# Altium project WiWi_SDR.PrjPcb (part 1 of 5)
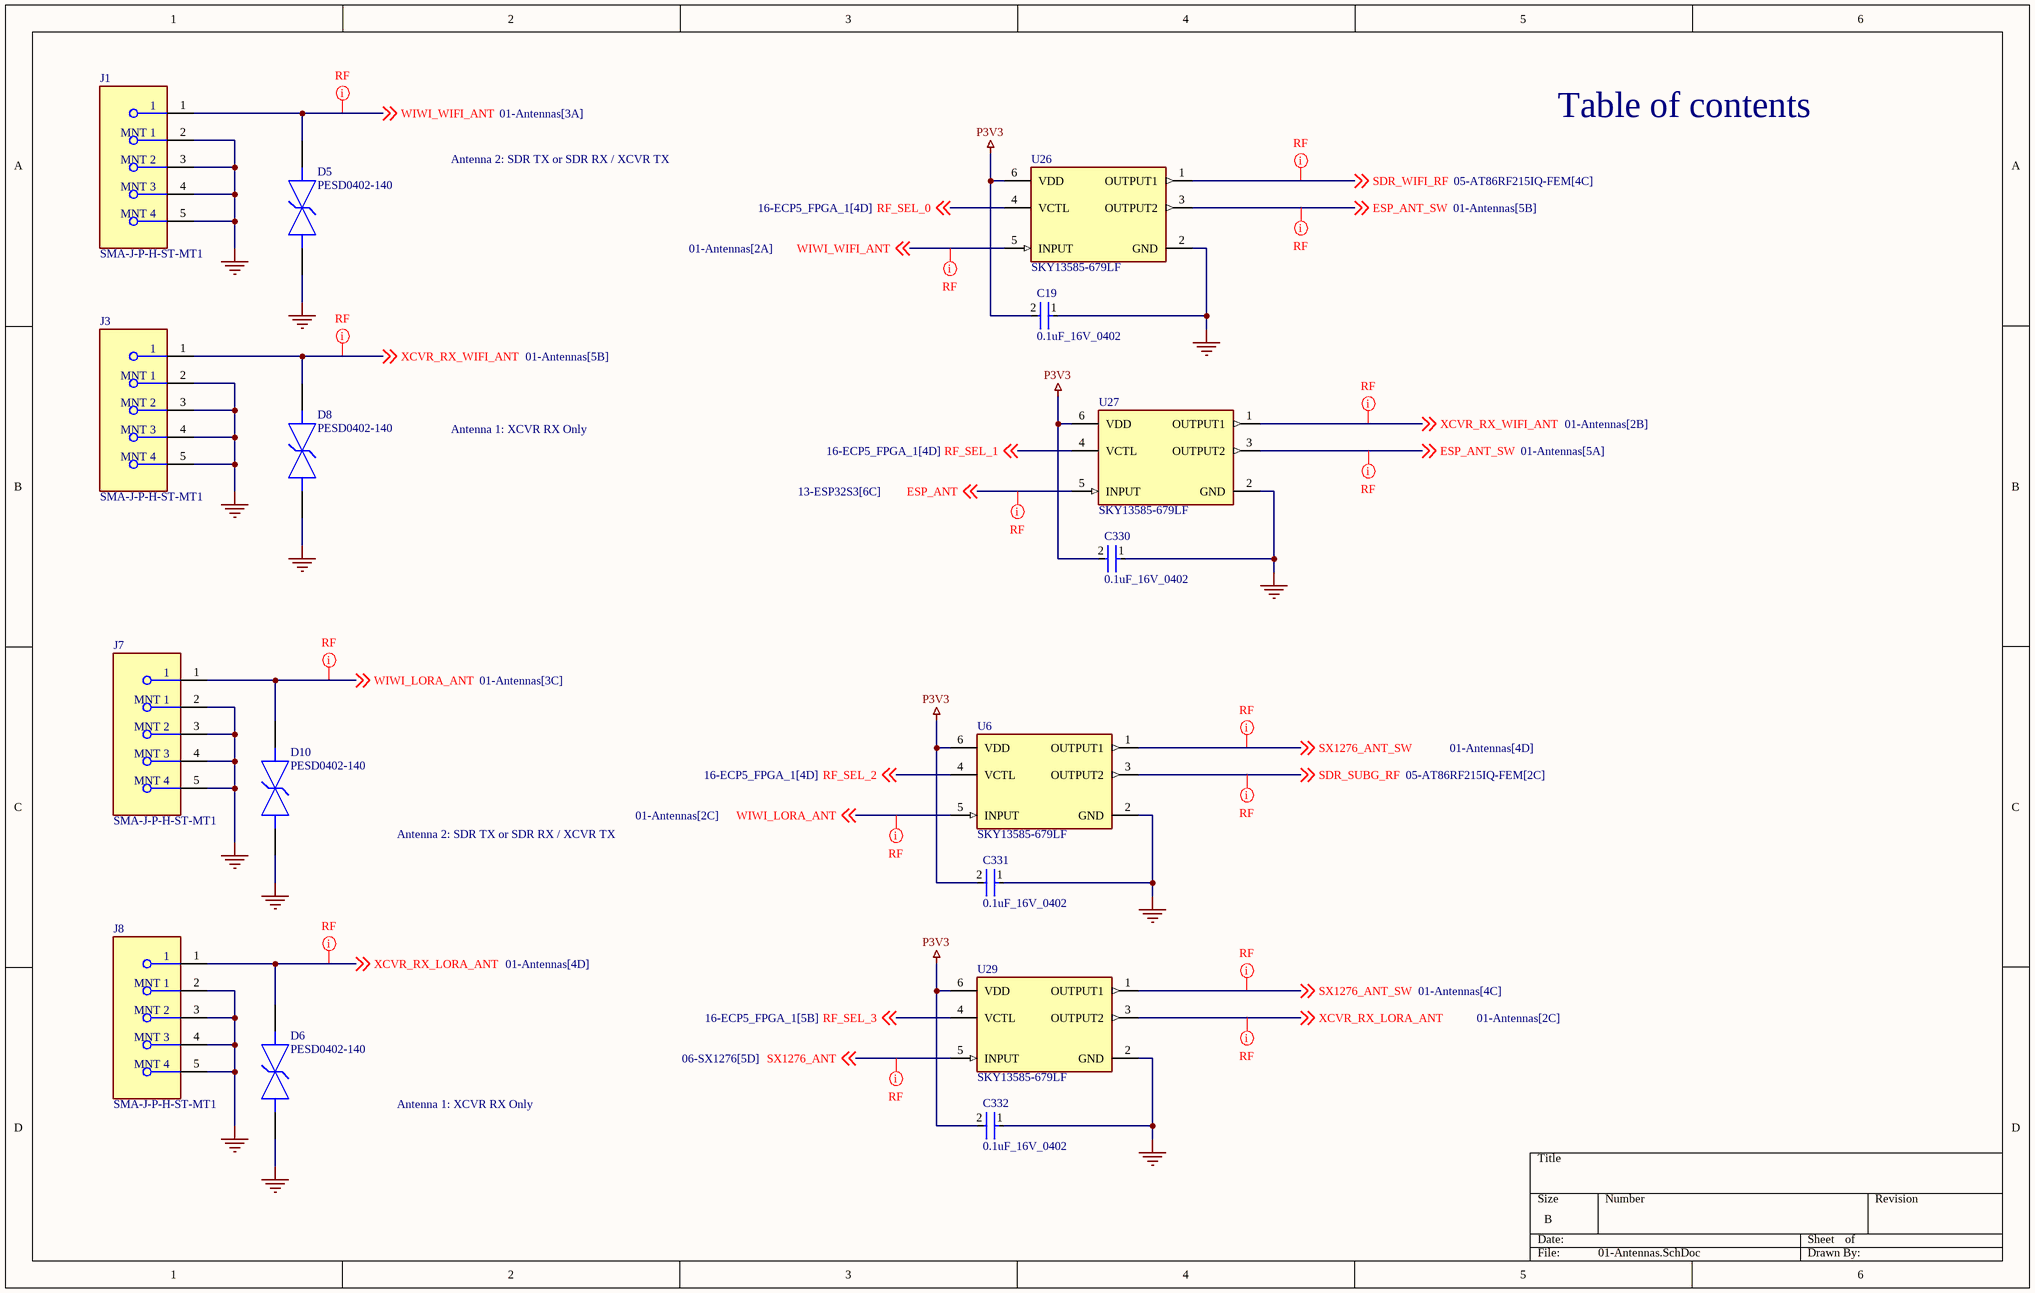
[diagram p0: 01-Antennas.SchDoc]
prjCompanyName: Meta Platforms Technologies, LLC.; prjContactAddress1: 9845 Willows Road NE; prjContactAddress2: Redmond, WA 98052; prjContactEmail: Contact Email; prjContactPhone: (...)-...-....; prjElectricalEngineer: Electical Engineer; prjElectricalEngineerEmail: Electical Engineer Email; prjLayoutEngineer: Layout Engineer; prjLayoutEngineerEmail: Layout Engineer Email; prjMechanicalEngineer: Mechanical Engineer; prjMechanicalEngineerEmail: Mechanical Engineer Email; prjPCB_IPN: 844-XXXXX-XX; prjPCB_Name: PCB Name; prjPCB_Revision: X1; prjProjectName: Project Name; prjSchematic_IPN: 846-XXXXX-XX; prjSchematic_Revision: X1; XprjPCBA_IPN: Set v_prjPCBA_IPN in variant parameters; XprjPCBA_Revision: Set v_prjPCBA_Revision in variant parameters
16 sheets, 513 parts. Net scope: global (net labels, ports and power ports of the same name join across sheets).
Board file: WiWi_SDR_V4.PcbDoc
Sheets:
  01-Antennas.SchDoc
  02-RCB_Header.SchDoc
  04-AT86RF215IQ.SchDoc
  05-AT86RF215IQ-FEM.SchDoc
  06-SX1276.SchDoc
  07-TCXO_Crystal.SchDoc
  08-STM32-01.SchDoc
  10-USB-Prog.SchDoc
  11-Power.SchDoc
  12-FPGA_Power.SchDoc
  13-ESP32S3.SchDoc
  14-DPLL_1.SchDoc
  16-ECP5_FPGA_1.SchDoc
  17-ECP5_FPGA_2.SchDoc
  18-USB_HS.SchDoc
  19-100M_Ethernet.SchDoc

## Sheet 01-Antennas.SchDoc
size B; SheetNumber: 1; SheetTotal: 19; SPICEModelCacheELOCFEDZ: <root> / <DocumentId>ELOCFEDZ</DocumentId> / </root>

### Parts
C19  0.1uF_16V_0402  [FP-C0402-BB-MFG]
C330  0.1uF_16V_0402  [FP-C0402-BB-MFG]
C331  0.1uF_16V_0402  [FP-C0402-BB-MFG]
C332  0.1uF_16V_0402  [FP-C0402-BB-MFG]
D5  PESD0402-140  [FP-PESD0402-MFG]
D6  PESD0402-140  [FP-PESD0402-MFG]
D8  PESD0402-140  [FP-PESD0402-MFG]
D10  PESD0402-140  [FP-PESD0402-MFG]
J1  SMA-J-P-H-ST-MT1  [FP-SMA-J-P-H-ST-MT1-MFG]
J3  SMA-J-P-H-ST-MT1  [FP-SMA-J-P-H-ST-MT1-MFG]
J7  SMA-J-P-H-ST-MT1  [FP-SMA-J-P-H-ST-MT1-MFG]
J8  SMA-J-P-H-ST-MT1  [FP-SMA-J-P-H-ST-MT1-MFG]
U6  SKY13585-679LF  [FP-SKY13585-679LF-MFG]
U26  SKY13585-679LF  [FP-SKY13585-679LF-MFG]
U27  SKY13585-679LF  [FP-SKY13585-679LF-MFG]
U29  SKY13585-679LF  [FP-SKY13585-679LF-MFG]

### Nets
GND: C19.1 C330.1 C331.1 C332.1 D5.1 D6.1 D8.1 D10.1 J1.2(MNT_1) J1.3(MNT_2) J1.4(MNT_3) J1.5(MNT_4) J3.2(MNT_1) J3.3(MNT_2) J3.4(MNT_3) J3.5(MNT_4) J7.2(MNT_1) J7.3(MNT_2) J7.4(MNT_3) J7.5(MNT_4) J8.2(MNT_1) J8.3(MNT_2) J8.4(MNT_3) J8.5(MNT_4) U6.2(GND) U26.2(GND) U27.2(GND) U29.2(GND)
P3V3: C19.2 C330.2 C331.2 C332.2 U6.6(VDD) U26.6(VDD) U27.6(VDD) U29.6(VDD)
ESP_ANT: U27.5(INPUT) ; off-sheet ESP_ANT
ESP_ANT_SW: U26.3(OUTPUT2) U27.3(OUTPUT2) ; off-sheet ESP_ANT_SW
RF_SEL_0: U26.4(VCTL) ; off-sheet RF_SEL_0
RF_SEL_1: U27.4(VCTL) ; off-sheet RF_SEL_1
RF_SEL_2: U6.4(VCTL) ; off-sheet RF_SEL_2
RF_SEL_3: U29.4(VCTL) ; off-sheet RF_SEL_3
SDR_SUBG_RF: U6.3(OUTPUT2) ; off-sheet SDR_SUBG_RF
SDR_WIFI_RF: U26.1(OUTPUT1) ; off-sheet SDR_WIFI_RF
SX1276_ANT: U29.5(INPUT) ; off-sheet SX1276_ANT
SX1276_ANT_SW: U6.1(OUTPUT1) U29.1(OUTPUT1) ; off-sheet SX1276_ANT_SW
WIWI_LORA_ANT: D10.2 J7.1 U6.5(INPUT) ; off-sheet WIWI_LORA_ANT
WIWI_WIFI_ANT: D5.2 J1.1 U26.5(INPUT) ; off-sheet WIWI_WIFI_ANT
XCVR_RX_LORA_ANT: D6.2 J8.1 U29.3(OUTPUT2) ; off-sheet XCVR_RX_LORA_ANT
XCVR_RX_WIFI_ANT: D8.2 J3.1 U27.1(OUTPUT1) ; off-sheet XCVR_RX_WIFI_ANT

### Layout directives
net class RF: ESP_ANT, ESP_ANT_SW, SDR_SUBG_RF, SDR_WIFI_RF, SX1276_ANT, SX1276_ANT_SW, WIWI_LORA_ANT, WIWI_WIFI_ANT, XCVR_RX_LORA_ANT, XCVR_RX_WIFI_ANT

### Notes on the sheet
- Antenna 2: SDR TX or SDR RX / XCVR TX
- Table of contents
- Antenna 1: XCVR RX Only

### Library data of the parts
C19 C330-C332 = CMP-1034-02068-3: CAP CER 0.1UF 16V 5% X7R 0402; Manufacturer: Kemet; Manufacturer Part Number: C0402C104J4RACTU; Value: 0.10 μF; Temperature Coefficient: 15%; Tolerance: 0.05; Material: Ceramic; ComponentLink2URL: https://content.kemet.com/datasheets/KEM_C1002_X7R_SMD.pdf; Automotive: No; Device Class L2: Capacitors; Temperature: -55°C to +125°C; RoHS: TRUE; Voltage Rating: 16 V; ComponentLink2Description: Datasheet; Device Class L3: Ceramic Capacitors; Temperature Range Low: -55°C; Ipc Land Pattern Name: CAPC10050X50; Device Class L1: Passive Components; Temperature Range High: +125°C; Package: C0402-BB; Capacitance: 0.10 μF; Category: Cap; Mouser Description: CAP CER 0.1UF 16V X7R 0402; Height: 0.55mm; Digikey Description: CAP CER 0.1UF 16V 5% X7R 0402; Octopart: https://octopart.com/c0402c104j4ractu-kemet-12573893; Temperature Characteristic: X7R; Lead Free: Yes
D5 D6 D8 D10 = CMP-08607-000011-1: TVS DIODE 14V 40V 0402; Manufacturer: Littelfuse Inc.; Automotive Grade: Grade 1; Capacitance: 0.25pF; Value: 0.25pF; Direction: Bidirectional; Number Of Channels: 1; Temperature Range Low: -55°C; Lead Free: Yes; Temperature: -55°C to +125°C; Digikey Description: TVS DIODE 14V 40V 0402; Automotive: Yes; Device Class L2: TVS Diodes; Reverse Standoff Voltage: 14V; Device Class L1: Circuit Protection; Ipc Land Pattern Name: DIOC10050X33; Manufacturer Part Number: PESD0402-140; Breakdown Voltage: 14V; Height: 0.43mm; Clamping Voltage: 40V; RoHS: TRUE; Temperature Range High: +125°C; Device Class L3: unset; Octopart: https://octopart.com/pesd0402-140-littelfuse-74215061; Package: PESD0402; ComponentLink2URL: https://www.littelfuse.com/~/media/electronics/datasheets/polymer_esd_suppressors/littelfuse_polymer_esd_suppressor_pesd_catalog_datasheet.pdf.pdf; Category: Diode; ComponentLink2Description: Datasheet
J1 J3 J7 J8 = CMP-02754-000007-1: CONN SMA JACK STR 50 OHM SMD; Dielectric Material: PTFE; Voltage Rating: 335V; Body Material: Brass; Center Contact Plating: Gold; Impedance: 50R; Number of Ports: 1; Max Frequency: 20GHz; Mount: Surface Mount; Contact Plating: Gold; Housing Color: Gold; Series: -; Fastening Type: Threaded; Packaging: Bulk; Connector Type: SMA; Contact Material: Copper Alloy; Body Plating: Gold; Case/Package: SMA; Termination: Solder; RoHS Compliant: No; Min Operating Temperature: -65°C; Max Operating Temperature: 125°C
U6 U26 U27 U29 = CMP-85923-000009-1: IC RF SWITCH SPDT 6GHZ 6MLPD; Insertion Loss: 0.5dB; Impedance: 50R; IIP3: 56dBm; Test Frequency: 2.5GHz; Packaging: Cut Tape; Throw Configuration: SPDT; Max Operating Temperature: 90°C; RoHS Compliant: Yes; Min Operating Temperature: -40°C; Series: -

## Sheet 02-RCB_Header.SchDoc
size B; SheetNumber: 2; SheetTotal: 14
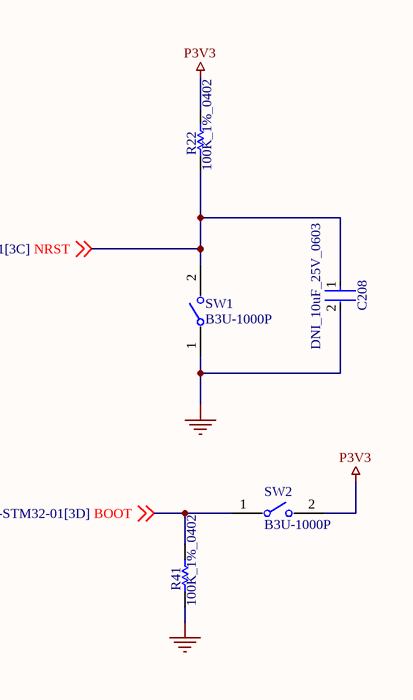
[diagram p1: 02-RCB_Header.SchDoc]

### Parts
C208  DNI_10uF_25V_0603  [FP-CL10-IPC_C]  (no BOM)
R22  100K_1%_0402  [RESC1005X40X25ML05T10]
R41  100K_1%_0402  [RESC1005X40X25ML05T10]
SW1  B3U-1000P  [FP-B3U-1000P-MFG]
SW2  B3U-1000P  [FP-B3U-1000P-MFG]

### Nets
GND: C208.2 R41.1 SW1.1
P3V3: R22.2 SW2.2
BOOT: R41.2 SW2.1 ; off-sheet BOOT
NRST: C208.1 R22.1 SW1.2 ; off-sheet NRST

### Library data of the parts
C208 = CMP-13271-004224-1: Cap Ceramic 10uF 25V X5R ±20% Pad SMD 0603 +85°C T/R; Width: 0.031inch; Voltage Rating: 25V; Length: 0.063inch; Case Code (Metric): 1608; Dielectric: X5R; Termination: Wraparound; Capacitance: 10uF; Lead Free: Lead Free; Mount: Surface Mount; Package Quantity: 1; Case Code (Imperial): 0603; Thickness: 0.035inch; Packaging: Tape and Reel; Contact Plating: Tin; Min Operating Temperature: -55°C; Tolerance: 20%; Max Operating Temperature: 85°C; Case/Package: 0603
R22 R41 = CMP-2002-07852-1: Manufacturer: Yageo; Part Number: RC0402FR-13100KL
SW1 SW2 = CMP-2100-03586-2: SWITCH TACTILE SPST-NO 0.05A 12V; Contact Resistance: 100mR; Operating Force: 1.5N; Max Current Rating: 50mA; Switch Travel: 0.15mm; Actuator Type: Standard; Mechanical Life: 200000Cycles; Ratings: Dust Proof; Illumination Type: Non-Illuminated; Throw Configuration: SPST; Actuator Length: 0.4mm; Switch Function: Off-Mom; Height: 1.2mm; Width: 3mm; Weight: 0.000776oz; Contact Material: Silver; Max Voltage Rating (DC): 12V; Insulation Resistance: 100MR; Lead Free: Lead Free; Current Rating: 50mA; Termination: SMD/SMT; Length: 4mm; Voltage Rating (DC): 12V; Contact Current Rating: 50mA; Orientation: Straight; Depth: 2.5mm; Max Operating Temperature: 70°C; Packaging: Tape and Reel; Min Operating Temperature: -25°C; Package Quantity: 1; Mount: Surface Mount; Electrical Life: 200000Cycles

## Sheet 04-AT86RF215IQ.SchDoc
size B; SheetNumber: 4; SheetTotal: 19
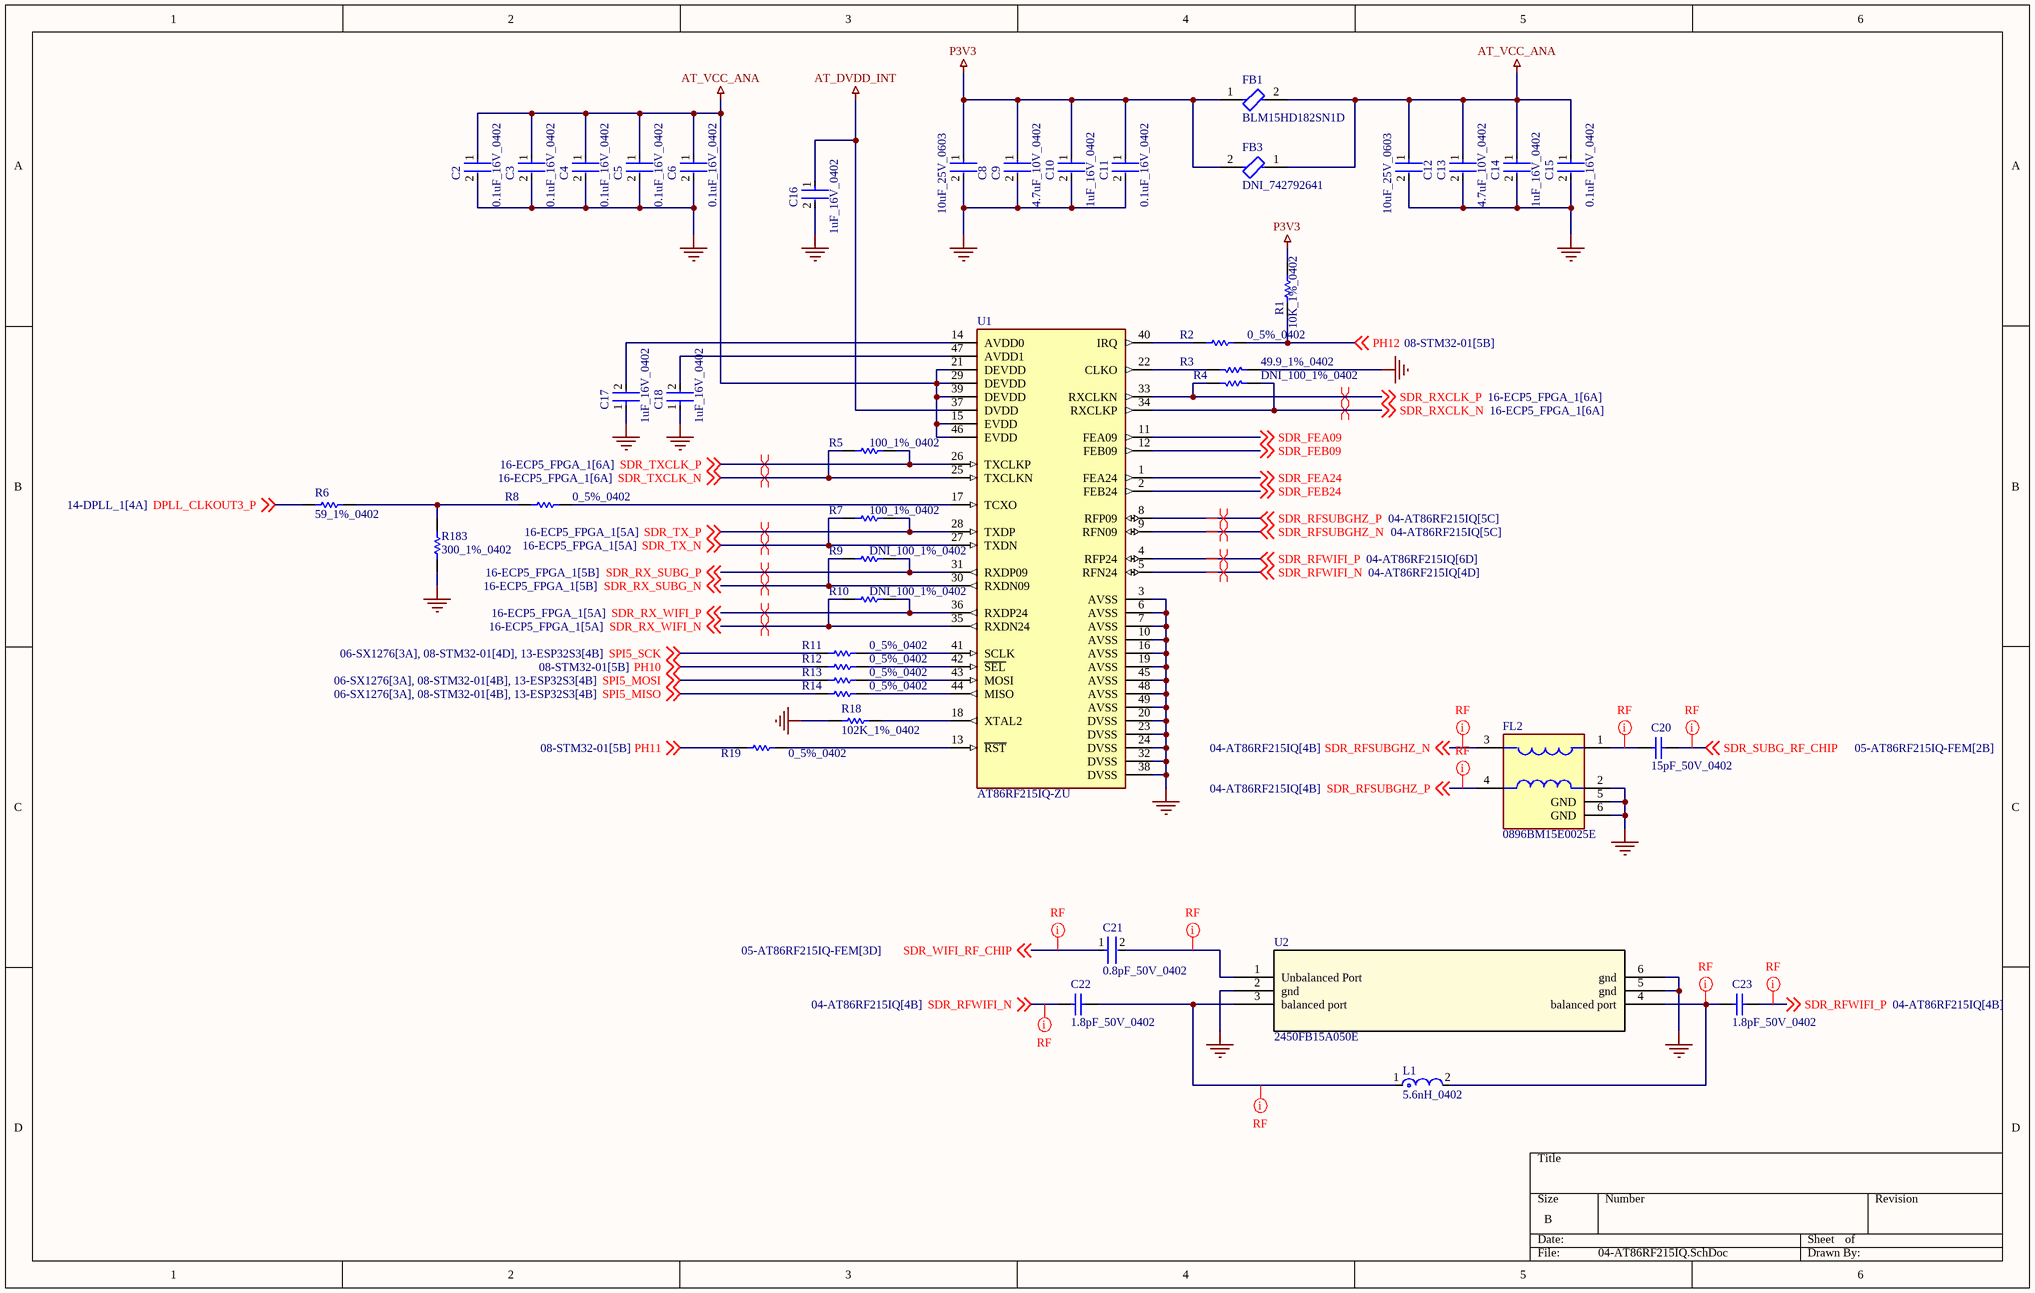
[diagram p2: 04-AT86RF215IQ.SchDoc]

### Parts
C2  0.1uF_16V_0402  [FP-C0402-BB-MFG]
C3  0.1uF_16V_0402  [FP-C0402-BB-MFG]
C4  0.1uF_16V_0402  [FP-C0402-BB-MFG]
C5  0.1uF_16V_0402  [FP-C0402-BB-MFG]
C6  0.1uF_16V_0402  [FP-C0402-BB-MFG]
C8  10uF_25V_0603  [FP-CL10-IPC_C]
C9  4.7uF_10V_0402  [FP-C1005-050-0_15-MFG]
C10  1uF_16V_0402  [FP-0402-L_1_0_0_05-W_0_5-IPC_A]
C11  0.1uF_16V_0402  [FP-C0402-BB-MFG]
C12  10uF_25V_0603  [FP-CL10-IPC_C]
C13  4.7uF_10V_0402  [FP-C1005-050-0_15-MFG]
C14  1uF_16V_0402  [FP-0402-L_1_0_0_05-W_0_5-IPC_A]
C15  0.1uF_16V_0402  [FP-C0402-BB-MFG]
C16  1uF_16V_0402  [FP-0402-L_1_0_0_05-W_0_5-IPC_A]
C17  1uF_16V_0402  [FP-0402-L_1_0_0_05-W_0_5-IPC_A]
C18  1uF_16V_0402  [FP-0402-L_1_0_0_05-W_0_5-IPC_A]
C20  15pF_50V_0402  [CAPC1005X55X25NL05T10]
C21  0.8pF_50V_0402  [FP-GJM155-0_05-IPC_A]
C22  1.8pF_50V_0402  [CAPC1005X55X25LL05T10]
C23  1.8pF_50V_0402  [CAPC1005X55X25LL05T10]
FB1  BLM15HD182SN1D  [FP-BLM15-0_05-MFG]
FB3  DNI_742792641  [FP-742792641-MFG]  (no BOM)
FL2  0896BM15E0025E  [FP-0896BM15E0025E-MFG]
L1  5.6nH_0402  [FP-LQG15HH_02-IPC_A]
R1  10K_1%_0402  [RESC1005X40X25NL10T10]
R2  0_5%_0402  [RESC1005X40X25NL05T10]
R3  49.9_1%_0402  [RESC1005X40X25NL10T10]
R4  DNI_100_1%_0402  [RESC1005X40X25NL05T10]  (no BOM)
R5  100_1%_0402  [RESC1005X40X25NL05T10]
R6  59_1%_0402  [RESC1005X40X25ML10T10]
R7  100_1%_0402  [RESC1005X40X25NL05T10]
R8  0_5%_0402  [RESC1005X40X25NL05T10]
R9  DNI_100_1%_0402  [RESC1005X40X25NL05T10]  (no BOM)
R10  DNI_100_1%_0402  [RESC1005X40X25NL05T10]  (no BOM)
R11  0_5%_0402  [RESC1005X40X25NL05T10]
R12  0_5%_0402  [RESC1005X40X25NL05T10]
R13  0_5%_0402  [RESC1005X40X25NL05T10]
R14  0_5%_0402  [RESC1005X40X25NL05T10]
R18  102K_1%_0402  [RESC1005X40X25ML05T10]
R19  0_5%_0402  [RESC1005X40X25NL05T10]
R183  300_1%_0402  [RESC1005X40X25LL10T10]
U1  AT86RF215IQ-ZU  [FP-AT86RF215IQ-ZU-MFG]
U2  2450FB15A050E  [2450FB15A050E_JOT]

### Nets
AT_DVDD_INT: C16.1 U1.37(DVDD)
AT_VCC_ANA: C2.1 C3.1 C4.1 C5.1 C6.1 C12.1 C13.1 C14.1 C15.1 FB1.2 FB3.1 U1.15(EVDD) U1.21(DEVDD) U1.29(DEVDD) U1.39(DEVDD) U1.46(EVDD)
GND: C2.2 C3.2 C4.2 C5.2 C6.2 C8.2 C9.2 C10.2 C11.2 C12.2 C13.2 C14.2 C15.2 C16.2 C17.1 C18.1 FL2.2(GND) FL2.5(GND) FL2.6(GND) R3.2 R18.1 R183.1 U1.3(AVSS) U1.6(AVSS) U1.7(AVSS) U1.10(AVSS) U1.16(AVSS) U1.19(AVSS) U1.20(DVSS) U1.23(DVSS) U1.24(DVSS) U1.32(DVSS) U1.38(DVSS) U1.45(AVSS) U1.48(AVSS) U1.49(AVSS) U2.2(gnd) U2.5(gnd) U2.6(gnd)
P3V3: C8.1 C9.1 C10.1 C11.1 FB1.1 FB3.2 R1.2
DPLL_CLKOUT3_P: R6.1 ; off-sheet DPLL_CLKOUT3_P
PH10: R12.1 ; off-sheet PH10
PH11: R19.1 ; off-sheet PH11
PH12: R1.1 R2.2 ; off-sheet PH12
SDR_FEA09: U1.11(FEA09) ; off-sheet SDR_FEA09
SDR_FEA24: U1.1(FEA24) ; off-sheet SDR_FEA24
SDR_FEB09: U1.12(FEB09) ; off-sheet SDR_FEB09
SDR_FEB24: U1.2(FEB24) ; off-sheet SDR_FEB24
SDR_RFSUBGHZ_N: FL2.3(1_Balanced_Port) U1.9(RFN09) ; off-sheet SDR_RFSUBGHZ_N
SDR_RFSUBGHZ_P: FL2.4(2_Balanced_Port) U1.8(RFP09) ; off-sheet SDR_RFSUBGHZ_P
SDR_RFWIFI_N: C22.1 U1.5(RFN24) ; off-sheet SDR_RFWIFI_N
SDR_RFWIFI_P: C23.2 U1.4(RFP24) ; off-sheet SDR_RFWIFI_P
SDR_RX_SUBG_N: R9.1 U1.30(RXDN09) ; off-sheet SDR_RX_SUBG_N
SDR_RX_SUBG_P: R9.2 U1.31(RXDP09) ; off-sheet SDR_RX_SUBG_P
SDR_RX_WIFI_N: R10.1 U1.35(RXDN24) ; off-sheet SDR_RX_WIFI_N
SDR_RX_WIFI_P: R10.2 U1.36(RXDP24) ; off-sheet SDR_RX_WIFI_P
SDR_RXCLK_N: R4.1 U1.34(RXCLKP) ; off-sheet SDR_RXCLK_N
SDR_RXCLK_P: R4.2 U1.33(RXCLKN) ; off-sheet SDR_RXCLK_P
SDR_SUBG_RF_CHIP: C20.2 ; off-sheet SDR_SUBG_RF_CHIP
SDR_TX_N: R7.1 U1.27(TXDN) ; off-sheet SDR_TX_N
SDR_TX_P: R7.2 U1.28(TXDP) ; off-sheet SDR_TX_P
SDR_TXCLK_N: R5.1 U1.25(TXCLKN) ; off-sheet SDR_TXCLK_N
SDR_TXCLK_P: R5.2 U1.26(TXCLKP) ; off-sheet SDR_TXCLK_P
SDR_WIFI_RF_CHIP: C21.1 ; off-sheet SDR_WIFI_RF_CHIP
SPI5_MISO: R14.1 ; off-sheet SPI5_MISO
SPI5_MOSI: R13.1 ; off-sheet SPI5_MOSI
SPI5_SCK: R11.1 ; off-sheet SPI5_SCK
NetC17_2: C17.2 U1.14(AVDD0)
NetC18_2: C18.2 U1.47(AVDD1)
NetC20_1: C20.1 FL2.1(Unbalanced_Port)
NetC21_2: C21.2 U2.1(Unbalanced_Port)
NetC22_2: C22.2 L1.1 U2.3(balanced_port)
NetC23_1: C23.1 L1.2 U2.4(balanced_port)
NetR2_1: R2.1 U1.40(IRQ)
NetR3_1: R3.1 U1.22(CLKO)
NetR6_2: R6.2 R8.1 R183.2
NetR8_2: R8.2 U1.17(TCXO)
NetR11_2: R11.2 U1.41(SCLK)
NetR12_2: R12.2 U1.42(~{SEL})
NetR13_2: R13.2 U1.43(MOSI)
NetR14_2: R14.2 U1.44(MISO)
NetR18_2: R18.2 U1.18(XTAL2)
NetR19_2: R19.2 U1.13(~{RST})

### Layout directives
differential pair: SDR_RFSUBGHZ_N, SDR_RFSUBGHZ_P, SDR_RFWIFI_N, SDR_RFWIFI_P, SDR_RX_SUBG_N, SDR_RX_SUBG_P, SDR_RX_WIFI_N, SDR_RX_WIFI_P, SDR_RXCLK_N, SDR_RXCLK_P, SDR_TX_N, SDR_TX_P, SDR_TXCLK_N, SDR_TXCLK_P
net class RF: NetC20_1, NetC21_2, NetC22_2, NetC23_1, SDR_RFSUBGHZ_N, SDR_RFSUBGHZ_P, SDR_RFWIFI_N, SDR_RFWIFI_P, SDR_SUBG_RF_CHIP, SDR_WIFI_RF_CHIP

### Library data of the parts
C2-C6 C11 C15 = CMP-1034-02068-3: as C19 on sheet 01-Antennas; ComponentLink2URL: https://content.kemet.com/datasheets/KEM_C1002_X7R_SMD.pdf; Automotive: No; Device Class L2: Capacitors; Temperature: -55°C to +125°C; RoHS: TRUE; Voltage Rating: 16 V; ComponentLink2Description: Datasheet; Device Class L3: Ceramic Capacitors; Temperature Range Low: -55°C; Ipc Land Pattern Name: CAPC10050X50; Device Class L1: Passive Components; Temperature Range High: +125°C; Package: C0402-BB; Capacitance: 0.10 μF; Category: Cap; Mouser Description: CAP CER 0.1UF 16V X7R 0402; Height: 0.55mm; Digikey Description: CAP CER 0.1UF 16V 5% X7R 0402; Octopart: https://octopart.com/c0402c104j4ractu-kemet-12573893; Temperature Characteristic: X7R; Lead Free: Yes
C8 C12 = CMP-13271-004224-1: as C208 on sheet 02-RCB_Header; Width: 0.031inch; Voltage Rating: 25V; Length: 0.063inch; Case Code (Metric): 1608; Dielectric: X5R; Termination: Wraparound; Capacitance: 10uF; Lead Free: Lead Free; Mount: Surface Mount; Package Quantity: 1; Case Code (Imperial): 0603; Thickness: 0.035inch; Packaging: Tape and Reel; Contact Plating: Tin; Min Operating Temperature: -55°C; Tolerance: 20%; Max Operating Temperature: 85°C; Case/Package: 0603
C9 C13 = CMP-2000-05997-2: CAP CER 4.7UF 10V X5R 0402; Dielectric Material: Ceramic; Tolerance: 10%; Series: C; Package Quantity: 10000; Max Operating Temperature: 85°C; Case Code (Imperial): 0402; Lead Free: Lead Free; Voltage Rating (DC): 10V; Packaging: Cut Tape; Voltage Rating: 10V; Min Operating Temperature: -55°C; Dielectric: X5R; Thickness: 0.022inch; Width: 0.02inch; Case/Package: 0402; Case Code (Metric): 1005; Capacitance: 4.7uF; Length: 0.039inch; RoHS Compliant: Yes; REACH SVHC: No SVHC; Mount: Surface Mount
C10 C14 C16-C18 = CMP-14477-000104-2: None; Tolerance: 10%; Voltage Rating: 16V; Dielectric: X5R; Capacitance: 1uF; Packaging: Tape and Reel; Depth: 0.5mm; Mount: Surface Mount; Thickness: 0.022inch; Package Quantity: 1; Min Operating Temperature: -55°C; Series: M; Voltage Rating (DC): 16V; Termination: SMD/SMT; Case/Package: 0402; Number of Pins: 2; Case Code (Imperial): 0402; Length: 1mm; Halogen Free: Halogen Free; Case Code (Metric): 1005; Width: 0.02inch; RoHS Compliant: Yes; Radiation Hardening: No; Max Operating Temperature: 85°C; Height: 0.5mm; Construction: Flat
C20 = CMP-2008-04267-1: Part Number: GRM1555C1H150JZ01D; Manufacturer: Murata
C21 = CMP-2008-03912-2: Multi-Layer Ceramic Capacitor 0.8pF C0G  ±0.1pF 0402 Paper T/R; Voltage: 50V; Height: 0.5mm; Min Operating Temperature: -55°C; Mount: Surface Mount; Length: 1mm; Packaging: Tape and Reel; Package Quantity: 1; Max Operating Temperature: 125°C; Dielectric: C0G; Case Code (Imperial): 0402; Voltage Rating (DC): 50V; Voltage Rating: 50V; Case Code (Metric): 1005; Depth: 0.5mm; Case/Package: 0402; Width: 0.02inch; Termination: SMD/SMT; Thickness: 0.022inch; Capacitance: 0.8pF; Radiation Hardening: No; Lead Free: Lead Free
C22 C23 = CMP-2008-03916-1: Part Number: GRM1555C1H1R8CA01D; Manufacturer: Murata
FB1 = CMP-0686-00276-4: Chip Ferrite Bead, 0402, 1800Ω @ 100MHz, 2.2Ω, 25%, 200mA; Impedance: 1.8kR; Number of Lines: 1; DC Resistance (DCR): 2.2R; Lead Free: Lead Free; Material: Ferrite; REACH SVHC: No SVHC; Current Rating: 200mA; Length: 1mm; Width: 0.5mm; Depth: 0.5mm; Max Operating Temperature: 125°C; Max DC Current: 200mA; Max Current Rating: 200mA; Case Code (Metric): 1005; Package Quantity: 1; Radiation Hardening: No; Number of Pins: 2; Tolerance: 25%; Number of Circuits: 1; Test Frequency: 100MHz; Termination: SMD/SMT; Military Standard: Not; Core Material: Ferrite; Height: 0.5mm; Case Code (Imperial): 0402; Packaging: Tape and Reel; Case/Package: 0402; DC Current: 200mA; Min Operating Temperature: -55°C
FB3 = CMP-0220-00171-2: FERRITE BEAD 300 OHM 0603 1LN; Inductance: 18nH; Max DC Current: 2A; Number of Lines: 1; Test Frequency: 100MHz; Impedance: 300R; DC Resistance (DCR): 150mR; Tolerance: 25%; Case Code (Metric): 1608; Core Material: Ferrite; Length: 1.6mm; Lead Free: Lead Free; Series: WE-CBF; Min Operating Temperature: -55°C; RoHS Compliant: Yes; Case/Package: SMD/SMT; Material: Ferrite; Max Operating Temperature: 125°C; Termination: SMD/SMT; Packaging: Tape and Reel; Weight: 0.000141oz; Case Code (Imperial): 0603; Width: 0.8mm; Mount: Surface Mount; Max Current Rating: 2A; Package Quantity: 1; Depth: 0.8mm; Current Rating: 2A; Height: 0.8mm
FL2 = CMP-56495-000001-1: BALUN 863MHZ-928MHZ 50/50 0805; Manufacturer: Johanson; Insertion Loss: 1.8dB; Frequency: 895.5MHz; Bandwidth: 863-928MHz; Filter Type: Low Pass; Automotive: No; Manufacturer Part Number: 0896BM15E0025E; Temperature Range Low: -40°C; Height: 1.05mm; Digikey Description: BALUN 863MHZ-928MHZ 50/50 0805; Mouser Description: Signal Conditioning 863/928MHz BALUN/FILTER; Category: Filter; ComponentLink2Description: Datasheet; Temperature: -40°C to +125°C; Lead Free: Yes; Temperature Range High: +125°C; ComponentLink2URL: https://www.johansontechnology.com/datasheets/0896BM15E0025/0896BM15E0025.pdf; Package: 0896BM15E0025E; Device Class L2: EMI / RFI Components; Device Class L3: RF; RoHS: TRUE; Octopart: https://octopart.com/0896bm15e0025e-johanson-71691697; Device Class L1: Passive Components
L1 = CMP-06042-000284-1: Multilayer type RF Inductor 5.6nH ±0.3nH 0.18Ω 600mA 0402; Core Material: Air; DC Current: 300mA; Shielding: Unshielded; Test Frequency: 100MHz; Self Resonant Frequency: 5.3GHz; Q Factor: 8; DC Resistance (DCR): 260mR; Package Quantity: 1; Number of Pins: 2; Height: 0.02inch; Mount: Surface Mount; Termination: SMD/SMT; Case/Package: 0402; Case Code (Metric): 1005; Packaging: Tape and Reel; Min Operating Temperature: -55°C; Max DC Current: 300mA; Width: 0.02inch; Case Code (Imperial): 0402; Lead Free: Lead Free; Inductance: 5.6nH; Max Operating Temperature: 125°C; REACH SVHC: No SVHC; Radiation Hardening: No; Height - Seated (Max): 0.022inch; Depth: 0.55mm; Military Standard: Not; Length: 1mm; Current Rating: 300mA
R1 = CMP-2002-04694-1: Manufacturer: Bourns; Part Number: CR0402-FX-1002GLF
R2 R8 R11-R14 R19 = CMP-2002-06457-1: Manufacturer: Panasonic; Part Number: ERJ-U020R00X
R3 = CMP-2002-04448-1: Part Number: RK73H1ETTP49R9F; Manufacturer: KOA Speer
R4 R5 R7 R9 R10 = CMP-2002-07853-1: Manufacturer: Yageo; Part Number: RC0402FR-13100RL
R6 = CMP-2002-04479-1: Manufacturer: KOA Speer; Part Number: RK73H1ETTP59R0F
R18 = CMP-2002-07345-1: Manufacturer: Yageo; Part Number: RC0402FR-07102KL
R183 = CMP-2002-06121-1: Part Number: MC00625W04021300R; Manufacturer: Multicomp
U1 = CMP-06331-000021-1: IC RF TXRX 802.15.4 48VFQFN; Manufacturer: Microchip; Data Rate: 2.4Mbits/s; Min Supply Voltage: 1.8V; Standoff Height: 0mm; Interface: SPI,Other; Sensitivity: -123dBm; Max Supply Voltage: 3.6V; Max Frequency: 2483.5MHz; Temperature Range High: +85°C; ComponentLink2URL: http://ww1.microchip.com/downloads/en/devicedoc/atmel-42415-wireless-at86rf215_datasheet.pdf; Lead Free: Yes; Digikey Description: IC RF TXRX 802.15.4 48VFQFN; Temperature: -40°C to +85°C; RoHS: TRUE; ComponentLink2Description: Datasheet; Height: 0.9mm; Temperature Range Low: -40°C; Manufacturer Part Number: AT86RF215IQ-ZU; Footprint Url: http://ww1.microchip.com/downloads/en/appnotes/atmel-8826-seeprom-pcb-mounting-guidelines-surface-mount-packages-applicationnote.pdf; Category: IC; Automotive: No; Ipc Land Pattern Name: QFN50P700X700X85-48; Device Class L1: Integrated Circuits (ICs); Octopart: https://octopart.com/at86rf215iq-zu-microchip-77758620; Package: QFN48; Device Class L2: RF Semiconductors and Devices; Device Class L3: Transceivers
U2 = 2450FB15A050E: No Description Available; Mfr_Name: Johanson Technology; RefDes: RefDes; Type: Type

## Sheet 05-AT86RF215IQ-FEM.SchDoc
size C; SheetNumber: 5; SheetTotal: 19
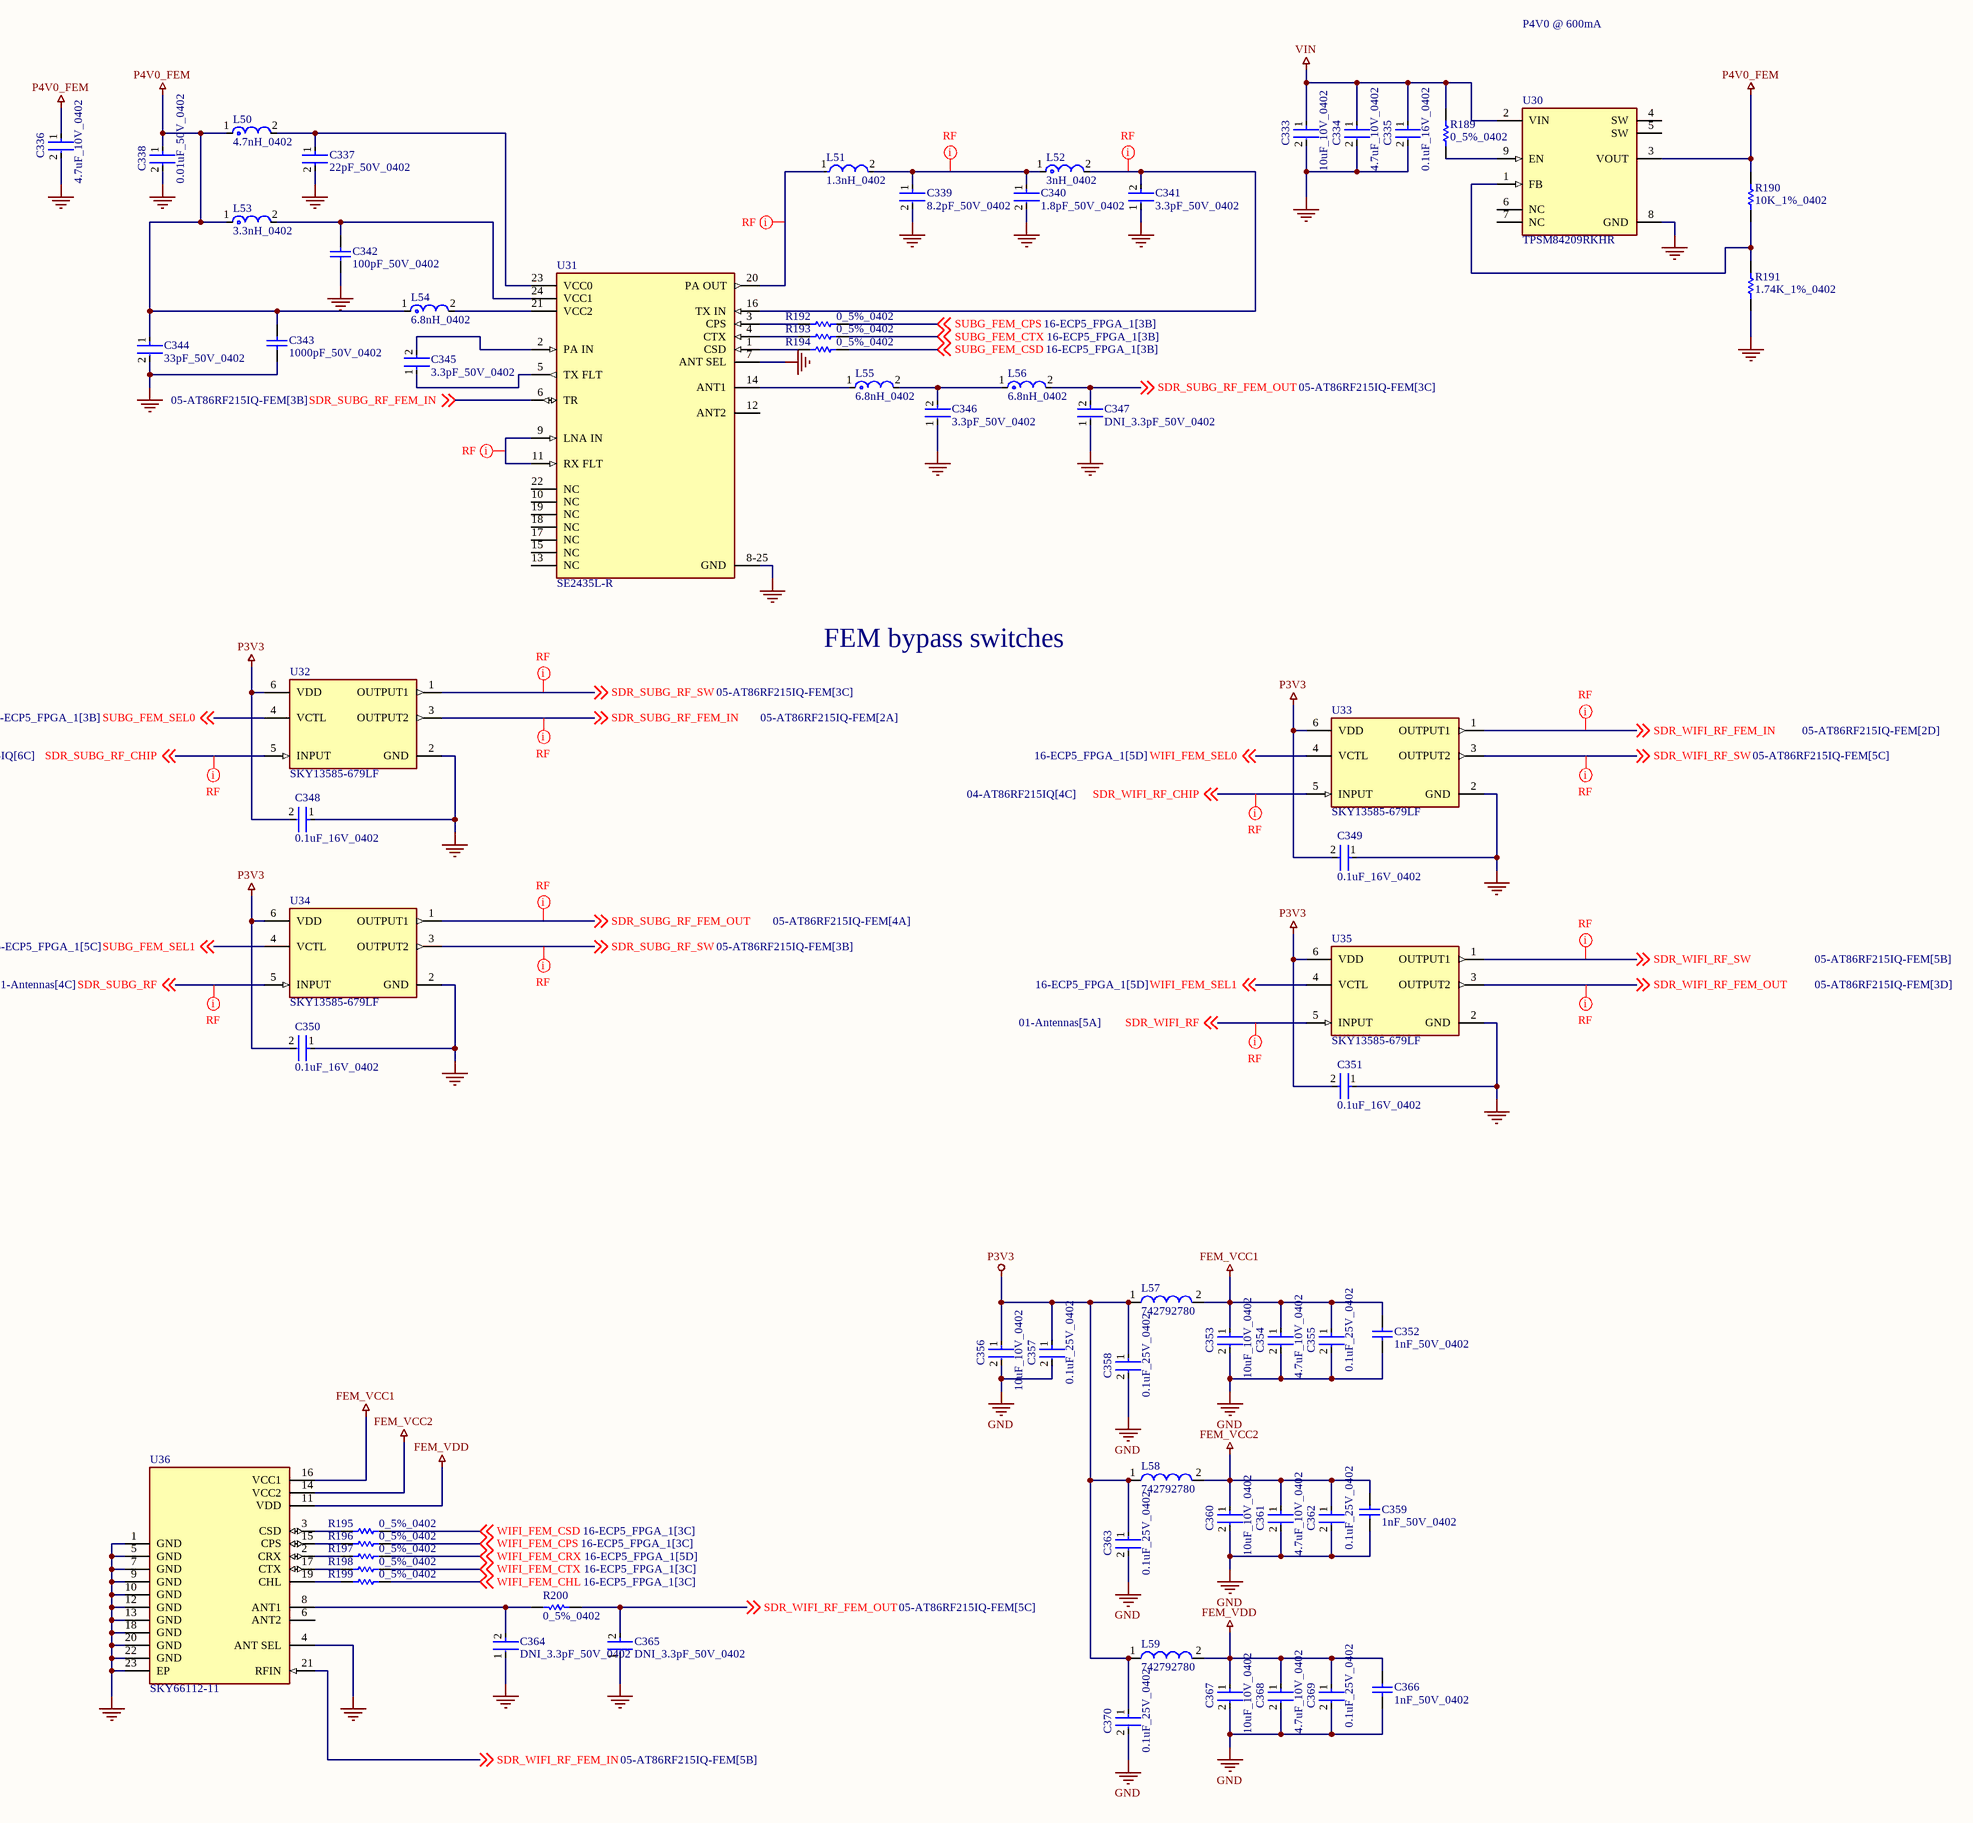
[diagram p3: 05-AT86RF215IQ-FEM.SchDoc]

### Parts
C333  10uF_10V_0402  [FP-CL05A106MP5NUNC-MFG]
C334  4.7uF_10V_0402  [FP-C1005-050-0_15-MFG]
C335  0.1uF_16V_0402  [FP-C0402-BB-MFG]
C336  4.7uF_10V_0402  [FP-C1005-050-0_15-MFG]
C337  22pF_50V_0402  [FP-0402-L_1_0_1-W_0_5_0_1-MFG]
C338  0.01uF_50V_0402  [FP-GCM155-0_05-IPC_C]
C339  8.2pF_50V_0402  [FP-GJM155-0_05-IPC_C]
C340  1.8pF_50V_0402  [FP-GJM155-0_05-IPC_B]
C341  3.3pF_50V_0402  [FP-CBR04C-MFG]
C342  100pF_50V_0402  [CAPC1005X55X25ML05T10]
C343  1000pF_50V_0402  [CAPC1005X55X25ML5T10]
C344  33pF_50V_0402  [FP-0402-L_1_0_1-W_0_5_0_1-IPC_A]
C345  3.3pF_50V_0402  [FP-GCM155-0_05-IPC_B]
C346  3.3pF_50V_0402  [FP-CBR04C-MFG]
C347  DNI_3.3pF_50V_0402  [FP-CBR04C-MFG]  (no BOM)
C348  0.1uF_16V_0402  [FP-C0402-BB-MFG]
C349  0.1uF_16V_0402  [FP-C0402-BB-MFG]
C350  0.1uF_16V_0402  [FP-C0402-BB-MFG]
C351  0.1uF_16V_0402  [FP-C0402-BB-MFG]
C352  1nF_50V_0402  [CAPC1005X55X25ML5T10]
C353  10uF_10V_0402  [FP-CL05A106MP5NUNC-MFG]
C354  4.7uF_10V_0402  [FP-C1005-050-0_15-MFG]
C355  0.1uF_25V_0402  [FP-0402-L_1_0_1-W_0_5_0_1-IPC_C]
C356  10uF_10V_0402  [FP-CL05A106MP5NUNC-MFG]
C357  0.1uF_25V_0402  [FP-0402-L_1_0_1-W_0_5_0_1-IPC_C]
C358  0.1uF_25V_0402  [FP-0402-L_1_0_1-W_0_5_0_1-IPC_C]
C359  1nF_50V_0402  [CAPC1005X55X25ML5T10]
C360  10uF_10V_0402  [FP-CL05A106MP5NUNC-MFG]
C361  4.7uF_10V_0402  [FP-C1005-050-0_15-MFG]
C362  0.1uF_25V_0402  [FP-0402-L_1_0_1-W_0_5_0_1-IPC_C]
C363  0.1uF_25V_0402  [FP-0402-L_1_0_1-W_0_5_0_1-IPC_C]
C364  DNI_3.3pF_50V_0402  [FP-CBR04C-MFG]  (no BOM)
C365  DNI_3.3pF_50V_0402  [FP-CBR04C-MFG]  (no BOM)
C366  1nF_50V_0402  [CAPC1005X55X25ML5T10]
C367  10uF_10V_0402  [FP-CL05A106MP5NUNC-MFG]
C368  4.7uF_10V_0402  [FP-C1005-050-0_15-MFG]
C369  0.1uF_25V_0402  [FP-0402-L_1_0_1-W_0_5_0_1-IPC_C]
C370  0.1uF_25V_0402  [FP-0402-L_1_0_1-W_0_5_0_1-IPC_C]
L50  4.7nH_0402  [FP-LQG15HH_02-IPC_B]
L51  1.3nH_0402  [FP-LQW15AN_00-W0_6-0_1-MFG]
L52  3nH_0402  [FP-LQG15HH_02-IPC_A]
L53  3.3nH_0402  [FP-LQG15HH_02-IPC_B]
L54  6.8nH_0402  [FP-LQG15HH_02-IPC_A]
L55  6.8nH_0402  [FP-LQG15HH_02-IPC_A]
L56  6.8nH_0402  [FP-LQG15HH_02-IPC_A]
L57  742792780  [SMD-0402]
L58  742792780  [SMD-0402]
L59  742792780  [SMD-0402]
R189  0_5%_0402  [RESC1005X40X25NL05T10]
R190  10K_1%_0402  [RESC1005X40X25LL05T10]
R191  1.74K_1%_0402  [RESC1005X40X25NL05T05]
R192  0_5%_0402  [RESC1005X40X25NL05T10]
R193  0_5%_0402  [RESC1005X40X25NL05T10]
R194  0_5%_0402  [RESC1005X40X25NL05T10]
R195  0_5%_0402  [RESC1005X40X25NL05T10]
R196  0_5%_0402  [RESC1005X40X25NL05T10]
R197  0_5%_0402  [RESC1005X40X25NL05T10]
R198  0_5%_0402  [RESC1005X40X25NL05T10]
R199  0_5%_0402  [RESC1005X40X25NL05T10]
R200  0_5%_0402  [RESC1005X40X25NL05T10]
U30  TPSM84209RKHR  [FP-RKH0009A-MFG]
U31  SE2435L-R  [FP-SE2435L-R-MFG]
U32  SKY13585-679LF  [FP-SKY13585-679LF-MFG]
U33  SKY13585-679LF  [FP-SKY13585-679LF-MFG]
U34  SKY13585-679LF  [FP-SKY13585-679LF-MFG]
U35  SKY13585-679LF  [FP-SKY13585-679LF-MFG]
U36  SKY66112-11  [FP-SKY66112-11-MFG]

### Nets
FEM_VCC1: C352.2 C353.1 C354.1 C355.1 L57.2 U36.16(VCC1)
FEM_VCC2: C359.2 C360.1 C361.1 C362.1 L58.2 U36.14(VCC2)
FEM_VDD: C366.2 C367.1 C368.1 C369.1 L59.2 U36.11(VDD)
GND: C333.2 C334.2 C335.2 C336.2 C337.2 C338.2 C339.2 C340.2 C341.1 C342.1 C343.1 C344.2 C346.1 C347.1 C348.1 C349.1 C350.1 C351.1 C352.1 C353.2 C354.2 C355.2 C356.2 C357.2 C358.2 C359.1 C360.2 C361.2 C362.2 C363.2 C364.1 C365.1 C366.1 C367.2 C368.2 C369.2 C370.2 R191.1 U30.8(GND) U31.7(ANT_SEL) U31.8-25(GND) U32.2(GND) U33.2(GND) U34.2(GND) U35.2(GND) U36.1(GND) U36.4(ANT_SEL) U36.5(GND) U36.7(GND) U36.9(GND) U36.10(GND) U36.12(GND) U36.13(GND) U36.18(GND) U36.20(GND) U36.22(GND) U36.23(EP)
P3V3: C348.2 C349.2 C350.2 C351.2 C356.1 C357.1 C358.1 C363.1 C370.1 L57.1 L58.1 L59.1 U32.6(VDD) U33.6(VDD) U34.6(VDD) U35.6(VDD)
P4V0_FEM: C336.1 C338.1 C343.2 C344.1 L50.1 L53.1 L54.1 R190.2 U30.3(VOUT)
VIN: C333.1 C334.1 C335.1 R189.2 U30.2(VIN)
SDR_SUBG_RF: U34.5(INPUT) ; off-sheet SDR_SUBG_RF
SDR_SUBG_RF_CHIP: U32.5(INPUT) ; off-sheet SDR_SUBG_RF_CHIP
SDR_SUBG_RF_FEM_IN: U31.6(TR) U32.3(OUTPUT2) ; off-sheet SDR_SUBG_RF_FEM_IN
SDR_SUBG_RF_FEM_OUT: C347.2 L56.2 U34.1(OUTPUT1) ; off-sheet SDR_SUBG_RF_FEM_OUT
SDR_SUBG_RF_SW: U32.1(OUTPUT1) U34.3(OUTPUT2) ; off-sheet SDR_SUBG_RF_SW
SDR_WIFI_RF: U35.5(INPUT) ; off-sheet SDR_WIFI_RF
SDR_WIFI_RF_CHIP: U33.5(INPUT) ; off-sheet SDR_WIFI_RF_CHIP
SDR_WIFI_RF_FEM_IN: U33.1(OUTPUT1) U36.21(RFIN) ; off-sheet SDR_WIFI_RF_FEM_IN
SDR_WIFI_RF_FEM_OUT: C365.2 R200.1 U35.3(OUTPUT2) ; off-sheet SDR_WIFI_RF_FEM_OUT
SDR_WIFI_RF_SW: U33.3(OUTPUT2) U35.1(OUTPUT1) ; off-sheet SDR_WIFI_RF_SW
SUBG_FEM_CPS: R192.2 ; off-sheet SUBG_FEM_CPS
SUBG_FEM_CSD: R194.2 ; off-sheet SUBG_FEM_CSD
SUBG_FEM_CTX: R193.2 ; off-sheet SUBG_FEM_CTX
SUBG_FEM_SEL0: U32.4(VCTL) ; off-sheet SUBG_FEM_SEL0
SUBG_FEM_SEL1: U34.4(VCTL) ; off-sheet SUBG_FEM_SEL1
WIFI_FEM_CHL: R199.2 ; off-sheet WIFI_FEM_CHL
WIFI_FEM_CPS: R196.2 ; off-sheet WIFI_FEM_CPS
WIFI_FEM_CRX: R197.2 ; off-sheet WIFI_FEM_CRX
WIFI_FEM_CSD: R195.2 ; off-sheet WIFI_FEM_CSD
WIFI_FEM_CTX: R198.2 ; off-sheet WIFI_FEM_CTX
WIFI_FEM_SEL0: U33.4(VCTL) ; off-sheet WIFI_FEM_SEL0
WIFI_FEM_SEL1: U35.4(VCTL) ; off-sheet WIFI_FEM_SEL1
NetC337_1: C337.1 L50.2 U31.23(VCC0)
NetC339_1: C339.1 C340.1 L51.2 L52.1
NetC341_2: C341.2 L52.2 U31.16(TX_IN)
NetC342_2: C342.2 L53.2 U31.24(VCC1)
NetC345_1: C345.1 U31.5(TX_FLT)
NetC345_2: C345.2 U31.2(PA_IN)
NetC346_2: C346.2 L55.2 L56.1
NetC364_2: C364.2 R200.2 U36.8(ANT1)
NetL51_1: L51.1 U31.20(PA_OUT)
NetL54_2: L54.2 U31.21(VCC2)
NetL55_1: L55.1 U31.14(ANT1)
NetR189_1: R189.1 U30.9(EN)
NetR190_1: R190.1 R191.2 U30.1(FB)
NetR192_1: R192.1 U31.3(CPS)
NetR193_1: R193.1 U31.4(CTX)
NetR194_1: R194.1 U31.1(CSD)
NetR195_1: R195.1 U36.3(CSD)
NetR196_1: R196.1 U36.15(CPS)
NetR197_1: R197.1 U36.2(CRX)
NetR198_1: R198.1 U36.17(CTX)
NetR199_1: R199.1 U36.19(CHL)
NetU31_9: U31.9(LNA_IN) U31.11(RX_FLT)

Not connected (* = marked no-connect by the designer): U30 4(SW) 5(SW) 6(NC) 7(NC); U31 10(NC) 12(ANT2) 13(NC) 15(NC) 17(NC) 18(NC) 19(NC) 22(NC); U36 6(ANT2)

### Layout directives
net class RF: NetC339_1, NetC341_2, NetL51_1, NetU31_9, SDR_SUBG_RF, SDR_SUBG_RF_CHIP, SDR_SUBG_RF_FEM_IN, SDR_SUBG_RF_FEM_OUT, SDR_SUBG_RF_SW, SDR_WIFI_RF, SDR_WIFI_RF_CHIP, SDR_WIFI_RF_FEM_IN, SDR_WIFI_RF_FEM_OUT, SDR_WIFI_RF_SW

### Notes on the sheet
- P4V0 @ 600mA
- FEM bypass switches

### Library data of the parts
C333 C353 C356 C360 C367 = CMP-13271-000002-1: CAP CER 10UF 10V X5R 0402; Manufacturer Part Number: CL05A106MP5NUNC; Manufacturer: Samsung; Temperature Coefficient: 15%; Tolerance: 20%; Material: Ceramic; Octopart: https://octopart.com/cl05a106mp5nunc-samsung-22457395; Voltage Rating: 10V; RoHS: TRUE; Value: 10uF; Height: 0.7mm; Digikey Description: CAP CER 10UF 10V X5R 0402; Automotive: No; Package: CL05A106MP5NUNC; Device Class L1: Passive Components; Capacitance: 10uF; Temperature Range High: +85°C; ComponentLink2Description: Datasheet; Device Class L2: Capacitors; Temperature Characteristic: X5R; Temperature: -55°C to +85°C; ComponentLink2URL: http://www.samsungsem.com/kr/support/product-search/mlcc/__icsFiles/afieldfile/2019/05/10/19-CL05A106MP5NUNC.pdf; Device Class L3: Ceramic Capacitors; Category: Cap; Temperature Range Low: -55°C; Ipc Land Pattern Name: CAPC10050X50; Lead Free: Yes
C334 C336 C354 C361 C368 = CMP-2000-05997-2: as C9 on sheet 04-AT86RF215IQ; Series: C; Package Quantity: 10000; Max Operating Temperature: 85°C; Case Code (Imperial): 0402; Lead Free: Lead Free; Voltage Rating (DC): 10V; Packaging: Cut Tape; Voltage Rating: 10V; Min Operating Temperature: -55°C; Dielectric: X5R; Thickness: 0.022inch; Width: 0.02inch; Case/Package: 0402; Case Code (Metric): 1005; Capacitance: 4.7uF; Length: 0.039inch; RoHS Compliant: Yes; REACH SVHC: No SVHC; Mount: Surface Mount
C335 C348-C351 = CMP-1034-02068-3: as C19 on sheet 01-Antennas; ComponentLink2URL: https://content.kemet.com/datasheets/KEM_C1002_X7R_SMD.pdf; Automotive: No; Device Class L2: Capacitors; Temperature: -55°C to +125°C; RoHS: TRUE; Voltage Rating: 16 V; ComponentLink2Description: Datasheet; Device Class L3: Ceramic Capacitors; Temperature Range Low: -55°C; Ipc Land Pattern Name: CAPC10050X50; Device Class L1: Passive Components; Temperature Range High: +125°C; Package: C0402-BB; Capacitance: 0.10 μF; Category: Cap; Mouser Description: CAP CER 0.1UF 16V X7R 0402; Height: 0.55mm; Digikey Description: CAP CER 0.1UF 16V 5% X7R 0402; Octopart: https://octopart.com/c0402c104j4ractu-kemet-12573893; Temperature Characteristic: X7R; Lead Free: Yes
C337 = CMP-2008-02613-2: General Purpose Ceramic Capacitor, 0402, 22pF, 5%, C0G, 30ppm/°C, 50V; Temperature Coefficient: 30ppm/°C; Mount: Surface Mount; Length: 1mm; Construction: Flat; Contact Plating: Tin; REACH SVHC: No SVHC; Case/Package: 0402; Voltage: 50V; Case Code (Imperial): 0402; Thickness: 0.022inch; Radiation Hardening: No; Number of Pins: 2; Tolerance: 5%; Max Operating Temperature: 125°C; RoHS Compliant: Yes; Voltage Rating: 50V; Case Code (Metric): 1005; Package Quantity: 1; Width: 0.02inch; Termination: SMD/SMT; Lead Free: Lead Free; Height: 0.5mm; Voltage Rating (DC): 50V; Capacitance: 22pF; Min Operating Temperature: -55°C; Series: -; Depth: 0.5mm; Dielectric: C0G; Packaging: Tape and Reel
C338 = CMP-2008-03723-3: Ceramic Capacitor for Automotive 10nF ±10% 50VDC X7R 0402 Paper T/R; Voltage Rating (DC): 50V; Min Operating Temperature: -55°C; Radiation Hardening: No; Mount: Surface Mount; Thickness: 0.022inch; Package Quantity: 1; Case Code (Imperial): 0402; Lead Free: Lead Free; Case/Package: 0402; Depth: 0.5mm; Termination: SMD/SMT; Tolerance: 10%; Voltage: 50V; Packaging: Tape and Reel; Width: 0.02inch; REACH SVHC: No SVHC; Height: 0.5mm; Max Operating Temperature: 125°C; Case Code (Metric): 1005; Voltage Rating: 50V; Capacitance: 10nF; Ratings: AEC-Q200; Length: 1mm; Dielectric: X7R
C339 = CMP-2008-03886-2: Multi-Layer Ceramic Capacitor 8.2pF C0G  ±0.25pF 0402 Paper T/R; Temperature Coefficient: 30ppm/°C; Voltage: 50V; Case Code (Metric): 1005; Max Operating Temperature: 125°C; Dielectric: C0G; Lead Free: Lead Free; Case/Package: 0402; Radiation Hardening: No; Length: 1mm; Thickness: 0.022inch; Case Code (Imperial): 0402; Number of Pins: 2; Depth: 0.5mm; Mount: Surface Mount; Termination: SMD/SMT; Voltage Rating (DC): 50V; Package Quantity: 1; Packaging: Tape and Reel; REACH SVHC: No SVHC; Min Operating Temperature: -55°C; Height: 0.5mm; Lead Pitch: 0.3mm; Capacitance: 8.2pF; Width: 0.5mm; Voltage Rating: 50V
C340 = CMP-2008-03825-2: Multi-Layer Ceramic Capacitor 1.8pF C0G  ±0.1pF 0402 Paper T/R; Voltage: 50V; Dielectric: C0G; Number of Pins: 2; Depth: 0.5mm; Case Code (Imperial): 0402; Max Operating Temperature: 125°C; Radiation Hardening: No; Width: 0.5mm; Thickness: 0.022inch; REACH SVHC: No SVHC; Mount: Surface Mount; Voltage Rating (DC): 50V; Case/Package: 0402; Length: 1mm; Case Code (Metric): 1005; Capacitance: 1.8pF; Packaging: Tape and Reel; Min Operating Temperature: -55°C; Termination: SMD/SMT; Lead Pitch: 0.3mm; Lead Free: Lead Free; Voltage Rating: 50V; Height: 0.5mm; Package Quantity: 10000
C341 C346 C347 C364 C365 = CMP-2008-00014-2: CAP CER 3.3PF 50V C0G/NP0 0402; Manufacturer Part Number: CBR04C339C5GAC; Manufacturer: KEMET; Temperature Characteristic: C0G; Tolerance: 0.25 pF; Material: Ceramic; Temperature Coefficient: 30ppm/°C; Voltage Rating: 50 V; Digikey Description: CAP CER 3.3PF 50V C0G/NP0 0402; ComponentLink2URL: https://content.kemet.com/datasheets/KEM_C1030_CBR_SMD.pdf; Temperature Range High: +125°C; ComponentLink2Description: Datasheet; RoHS: TRUE; Device Class L1: Passive Components; Category: Cap; Lead Free: Yes; Mouser Description: Cap Ceramic 3.3pF 50V C0G 0.25pF SMD 0402 125°C Paper T/R; Ipc Land Pattern Name: CAPC10050X50; Automotive: No; Device Class L3: Ceramic Capacitors; Temperature: -55°C to +125°C; Device Class L2: Capacitors; Package: CBR04C; Value: 3.3 pF; Height: 0.55mm; Octopart: https://octopart.com/cbr04c339c5gac-kemet-20446747; Temperature Range Low: -55°C; Capacitance: 3.3 pF
C342 = CMP-2008-03915-1: Manufacturer: Murata; Part Number: GRM1555C1H101JA01D
C343 C352 C359 C366 = CMP-1662-00017-1: Chip Capacitor, 1 nF, +/- 10%, 50 V, -55 to 125 degC, 0402 (1005 Metric), RoHS, Tape and Reel; Case\/Package: 0402; Type (Capacitors): X7R; Voltage Rating (DC): 50 V; Capacitance: 1 nF; Width: 0.5 mm; Pins: 2; REACH SVHC: No SVHC; Length: 1 mm; Height: 0.5 mm; PackageDescription: 2-Pin Surface Mount Device, Body 1 x 0.5 mm; DatasheetVersion: 07/2016; Mount: Surface Mount; ComponentLink2Description: Datasheet; Tolerance: 10%; ComponentLink2URL: http://psearch.en.murata.com/capacitor/product/GRM155R71H102KA01%23.pdf; ComponentLink1URL: http://www.murata.com/; Case Code (Metric): 1005; Package Quantity: 10000; Min Operating Temperature: -55 degC; Max Operating Temperature: 125 degC; Voltage Rating: 50 V; ComponentLink1Description: Manufacturer URL; Packaging: Tape and Reel; Radiation Hardening: No; RoHSCompliant: true; PackageReference: 0402; Mounting Technology: Surface Mount; Case Code (Imperial): 0402
C344 = CMP-2008-02637-2: General Purpose Ceramic Capacitor, 0402, 33pF, 5%, C0G, 30ppm/°C, 50V; Insulation Resistance: 100GR; REACH SVHC: No SVHC; Radiation Hardening: No; Voltage Rating (DC): 50V; Tolerance: 5%; Voltage Rating: 50V; Mount: Surface Mount; Packaging: Tape and Reel; Construction: Flat; Voltage: 50V; Case/Package: 0402; Temperature Coefficient: 30ppm/°C; Lead Free: Lead Free; Case Code (Metric): 1005; Number of Pins: 2; Min Operating Temperature: -55°C; Capacitance: 33pF; Width: 0.5mm; Dielectric: C0G; Height: 0.5mm; Thickness: 0.022inch; Contact Plating: Tin; Length: 1mm; Package Quantity: 1; Depth: 0.5mm; Termination: SMD/SMT; Max Operating Temperature: 125°C; RoHS Compliant: Yes; Case Code (Imperial): 0402; Series: -
C345 = CMP-06035-045561-1: Ceramic Capacitor for Automotive 3.3pF ±0.25pF 50VDC C0G 0402 Paper T/R; Voltage Rating (DC): 50V; Max Operating Temperature: 125°C; Height: 0.5mm; Mount: Surface Mount; Case Code (Imperial): 0402; Packaging: Tape and Reel; Dielectric: C0G; Weight: 0.000212oz; Ratings: AEC-Q200; Length: 0.039inch; Case/Package: 0402; Thickness: 0.022inch; Min Operating Temperature: -55°C; Termination: SMD/SMT; Voltage Rating: 50V; Width: 0.02inch; Package Quantity: 10000; Capacitance: 3.3pF; Case Code (Metric): 1005
C355 C357 C358 C362 C363 C369 C370 = CMP-2008-02519-2: General Purpose Ceramic Capacitor, 0402, 100nF, 10%, X7R, 15%, 25V; Package Quantity: 1; Capacitance: 100nF; Min Operating Temperature: -55°C; Voltage: 25V; Voltage Rating: 25V; Construction: Flat; Max Operating Temperature: 125°C; Radiation Hardening: No; Depth: 0.5mm; Thickness: 0.022inch; Voltage Rating (DC): 25V; Number of Pins: 2; Lead Free: Lead Free; Series: -; REACH SVHC: No SVHC; Length: 1mm; Dielectric: X7R; RoHS Compliant: Yes; Mount: Surface Mount; Packaging: Tape and Reel; Case/Package: 0402; Case Code (Imperial): 0402; Termination: SMD/SMT; Width: 0.02inch; Case Code (Metric): 1005; Tolerance: 10%
L50 = CMP-06042-003214-1: Multilayer type RF Inductor 4.7nH ±0.2nH 0.16Ω 700mA 0402; Self Resonant Frequency: 6GHz; Core Material: Air; DC Resistance (DCR): 160mR; Shielding: Unshielded; Test Frequency: 100MHz; Case Code (Metric): 1005; Packaging: Cut Tape; Case Code (Imperial): 0402; Max Operating Temperature: 125°C; Current Rating: 700mA; Inductance: 4.7nH; Mount: Surface Mount; Case/Package: 0402; Min Operating Temperature: -55°C
L51 = CMP-06042-000011-2: Wire Wound RF Inductor 1.3nH ±0.2nH 1200mA 0.017Ω 0402 (1005); Shielding: Unshielded; Test Frequency: 100MHz; Core Material: Air; Max DC Current: 1.2A; DC Resistance (DCR): 17mR; Self Resonant Frequency: 16GHz; Max Operating Temperature: 125°C; Case Code (Metric): 1005; Case Code (Imperial): 0402; Depth: 0.7mm; Lead Free: Lead Free; Case/Package: 0402; Length: 1mm; Height: 0.5mm; Package Quantity: 10000; Military Standard: Not; Radiation Hardening: No; Weight: 2.8E-05oz; Inductance: 1.3nH; Termination: SMD/SMT; Mount: Surface Mount; Current Rating: 1.2A; Packaging: Tape and Reel; Width: 0.02inch; DC Current: 1.2A; Min Operating Temperature: -55°C; Number of Pins: 2; REACH SVHC: No SVHC
L52 = CMP-06042-002412-1: Multilayer type RF Inductor 3nH ±0.3nH 0.125Ω 800mA 0402; Q Factor: 8; Max DC Current: 300mA; Core Material: Air; Self Resonant Frequency: 6GHz; Test Frequency: 100MHz; DC Resistance (DCR): 170mR; Shielding: Unshielded; Height - Seated (Max): 0.022inch; Package Quantity: 10000; Radiation Hardening: No; Case/Package: 0402; Packaging: Tape and Reel; Inductance: 3nH; Termination: SMD/SMT; Lead Free: Lead Free; Min Operating Temperature: -55°C; Height: 0.5mm; Depth: 0.55mm; Mount: Surface Mount; Case Code (Metric): 1005; Length: 1mm; Case Code (Imperial): 0402; Military Standard: Not; DC Current: 300mA; Current Rating: 300mA; Max Operating Temperature: 125°C; Width: 0.02inch
L53 = CMP-06042-000228-1: Multilayer type RF Inductor 3.3nH ±0.3nH 0.125Ω 800mA 0402; Test Frequency: 100MHz; Core Material: Air; DC Resistance (DCR): 170mR; Shielding: Unshielded; DC Current: 300mA; Self Resonant Frequency: 6GHz; Q Factor: 8; Radiation Hardening: No; Packaging: Tape and Reel; Termination: SMD/SMT; Case Code (Metric): 1005; Width: 0.02inch; Max Operating Temperature: 125°C; Case Code (Imperial): 0402; Length: 1mm; Depth: 0.55mm; Height - Seated (Max): 0.022inch; Lead Free: Lead Free; Inductance: 3.3nH; Package Quantity: 1; Min Operating Temperature: -55°C; Height: 0.5mm; Max DC Current: 300mA; Current Rating: 300mA; Mount: Surface Mount; Military Standard: Not; Case/Package: 0402
L54-L56 = CMP-06042-003922-1: Multilayer type RF Inductor 6.8nH ±5% 0.22Ω 600mA 0402; Q Factor: 8; DC Current: 300mA; Self Resonant Frequency: 4.5GHz; DC Resistance (DCR): 240mR; Test Frequency: 100MHz; Core Material: Air; Shielding: Unshielded; Inductance: 6.8nH; Height: 0.5mm; Max Operating Temperature: 125°C; Height - Seated (Max): 0.022inch; Lead Free: Lead Free; Package Quantity: 10000; Min Operating Temperature: -55°C; Case/Package: 0402; Radiation Hardening: No; Case Code (Imperial): 0402; Depth: 0.55mm; Termination: SMD/SMT; Width: 0.02inch; Current Rating: 300mA; Max DC Current: 300mA; Tolerance: 5%; Length: 1mm; Military Standard: Not; Mount: Surface Mount; Case Code (Metric): 1005; Packaging: Tape and Reel
L57-L59 = CMP-0220-00137-1: SMD EMI Suppression Ferrite Bead WE-CBF, Z = 220 Ohm; Impedance: 220 Ohm; PackageVersion: 2009; DatasheetVersion: ver 4, Jul-2009; PackageDescription: Chip Inductor, 2-Leads, Body 1.0 x 0.5 mm; ComponentLink1URL: http://www.we-online.com; ComponentLink1Description: Manufacturer Link; ComponentLink2URL: http://www.we-online.de/katalog/media/pdf/742792780.pdf; PackageReference: SMD-0402; ComponentLink2Description: Datasheet
R189 R192-R200 = CMP-2002-06457-1: as R2 on sheet 04-AT86RF215IQ
R190 = CMP-2002-07353-1: Part Number: RC0402FR-0710KL; Manufacturer: Yageo / Phycomp
R191 = CMP-2002-00727-1: Manufacturer: Panasonic; Part Number: ERJ-2RKF1741X
U30 = CMP-04918-000417-1: DC DC CONVERTER 1.2-6V
U31 = CMP-85923-000004-1: IC FRONT END 930MHZ ISM 24QFN; Operating Frequency: 860 MHz to 930 MHz; Operating Supply Current: 50mA; Operating Supply Voltage: 3V; Min Operating Temperature: -40°C; Packaging: Tape and Reel; Case/Package: QFN; Series: SiGe; Package Quantity: 1; Max Operating Temperature: 85°C; Frequency: 930MHz; Weight: 0.032741oz
U32-U35 = CMP-85923-000009-1: as U6 on sheet 01-Antennas; Packaging: Cut Tape; Throw Configuration: SPDT; Max Operating Temperature: 90°C; RoHS Compliant: Yes; Min Operating Temperature: -40°C; Series: -
U36 = CMP-85923-000012-1: CONNECTED HOME/WEARABLEBLE+ZIGBE; Frequency: 2.4GHz; Packaging: Cut Tape; Series: -; RoHS Compliant: Yes; Case/Package: SMD/SMT